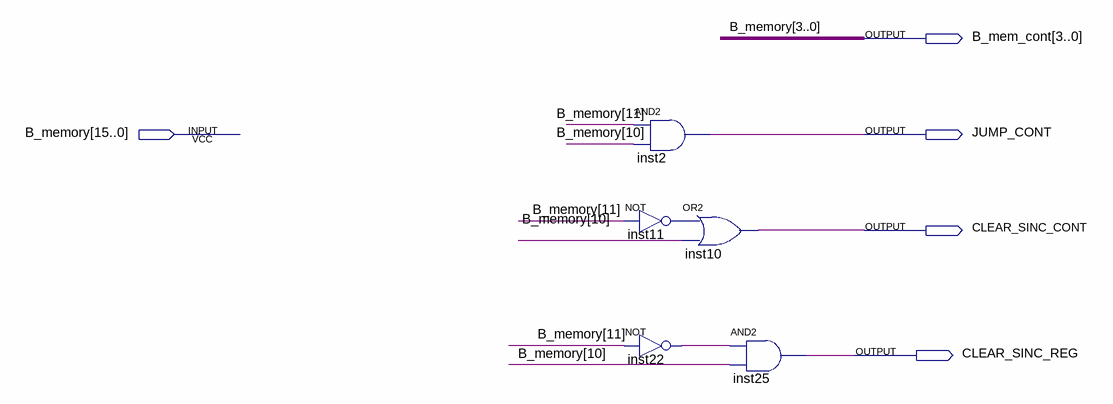
[diagram p0: schematic sheet]
// Quartus schematic unidade_controle.bdf as structural Verilog: 5 symbols, 5 pins
module unidade_controle (
  input  [15:0] B_memory,
  output [3:0] B_mem_cont,
  output JUMP_CONT,
  output CLEAR_SINC_CONT,
  output CLEAR_SINC_REG
);

  wire inst11_out, inst22_out;

  and inst2 (JUMP_CONT, B_memory[11], B_memory[10]);
  or inst10 (CLEAR_SINC_CONT, inst11_out, B_memory[10]);
  not inst11 (inst11_out, B_memory[11]);
  not inst22 (inst22_out, B_memory[11]);
  and inst25 (CLEAR_SINC_REG, inst22_out, B_memory[10]);

  assign B_mem_cont = B_memory[3:0];
endmodule
